# EasyEDA Pro project Signal-blocker-Minimal.epro

# Schematic Schematic1_1

## Sheets
1 Power Supply: Board Name: Minimal; Create Date: 2025-02-25; Page Name: Power Supply; Project Name: Signal-blocker-Minimal; Schematic Name: Schematic1_1; Update Date: 2025-02-25; Company: 嘉立创EDA; Page Size: A4; Version: V1.0
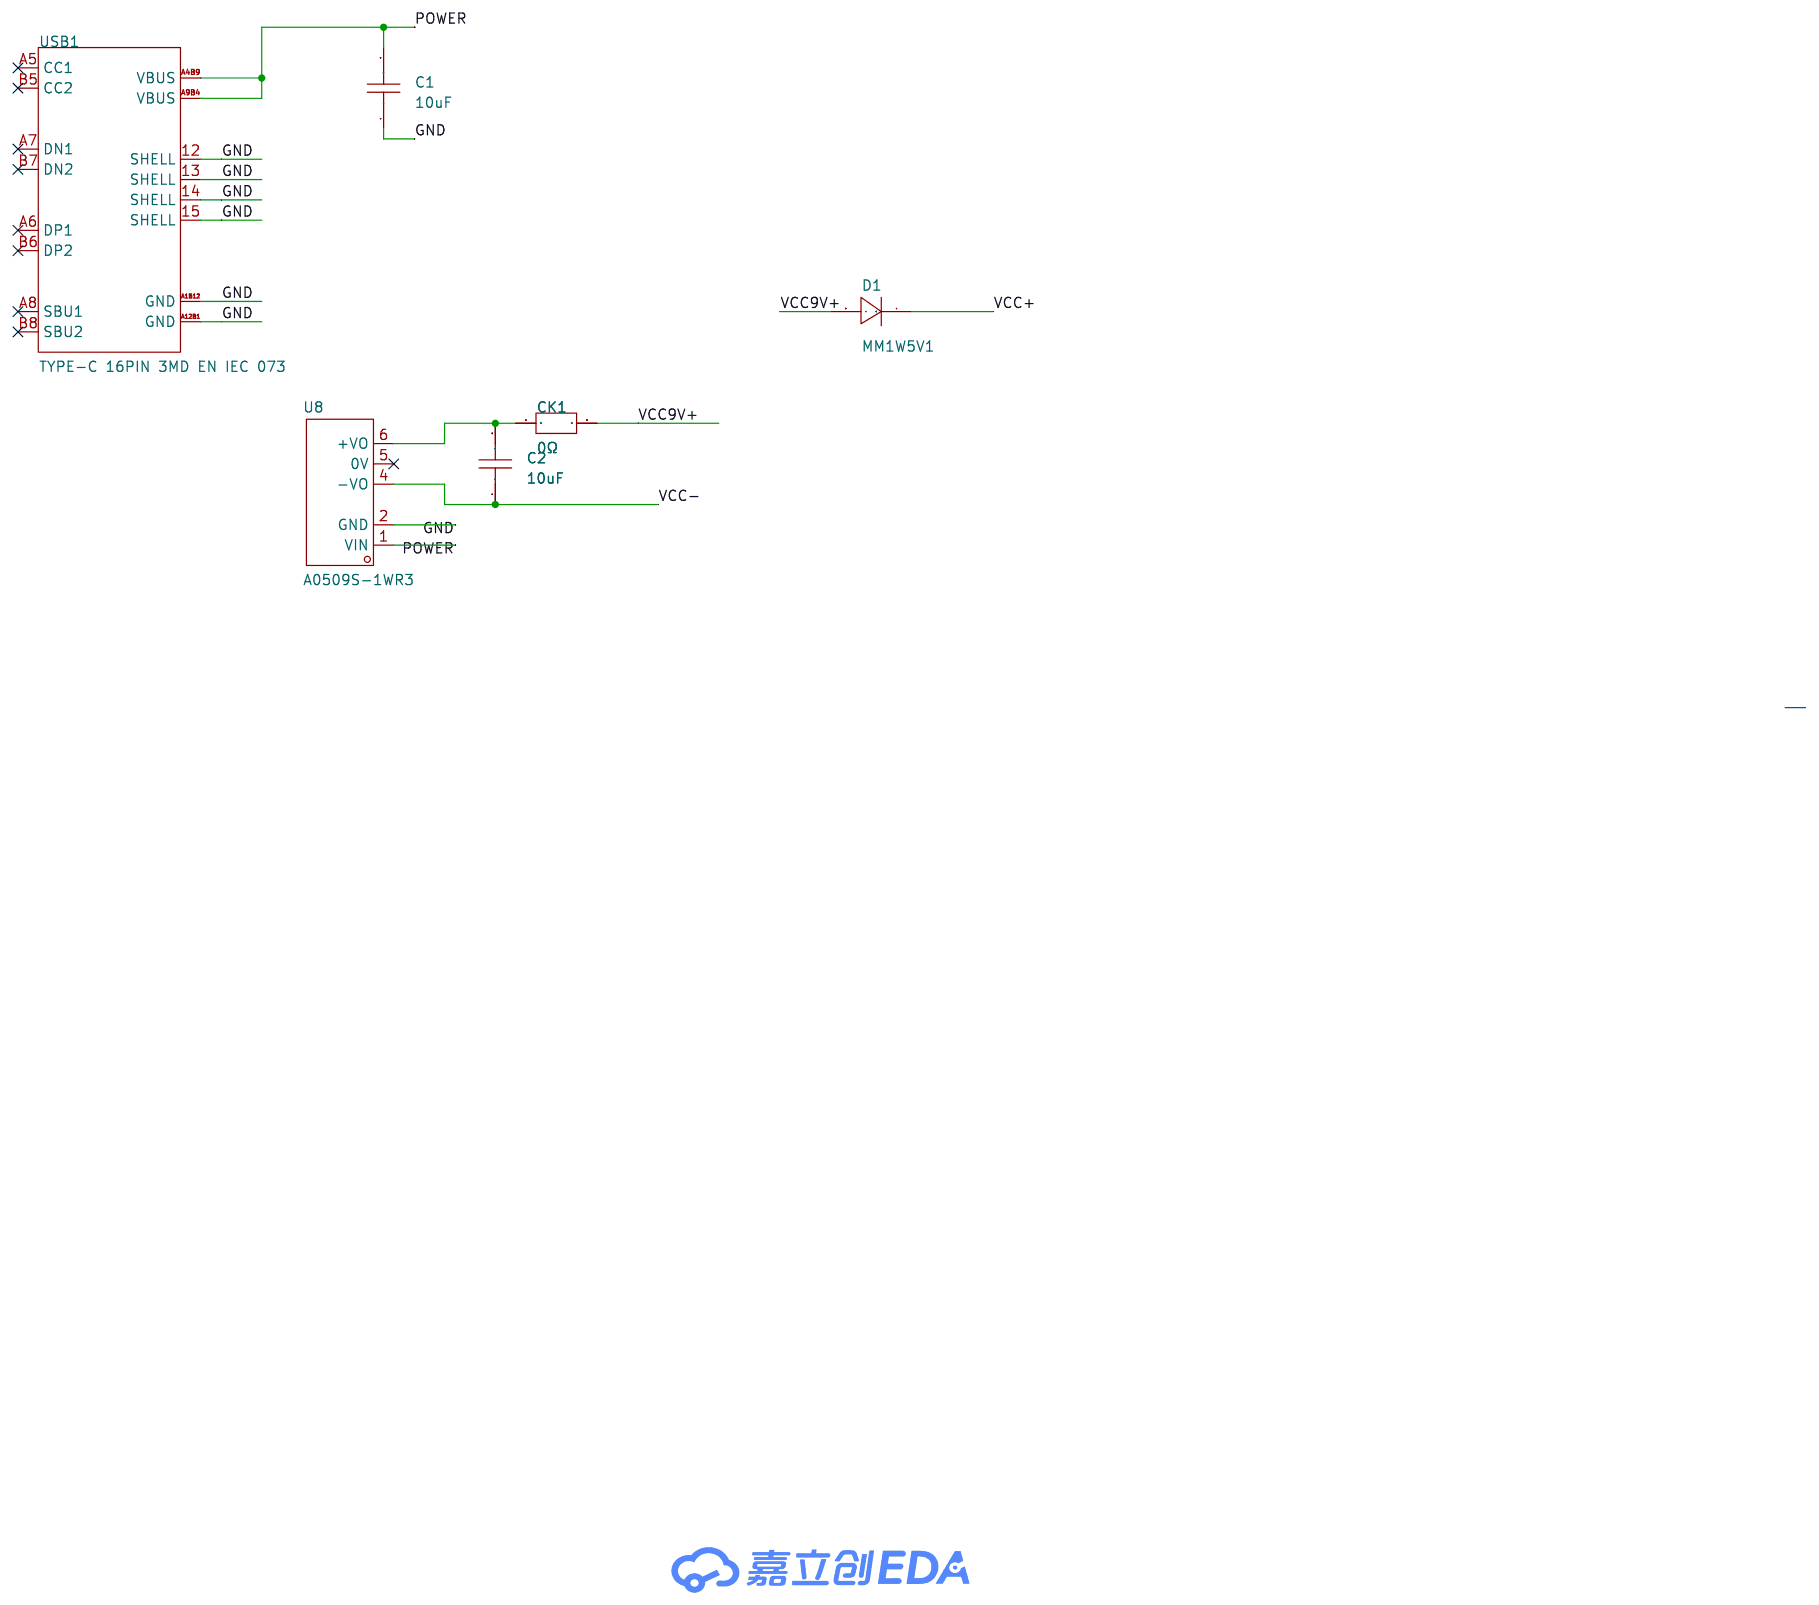
[diagram p0: Power Supply]
2 VCO Module: Page Name: VCO Module
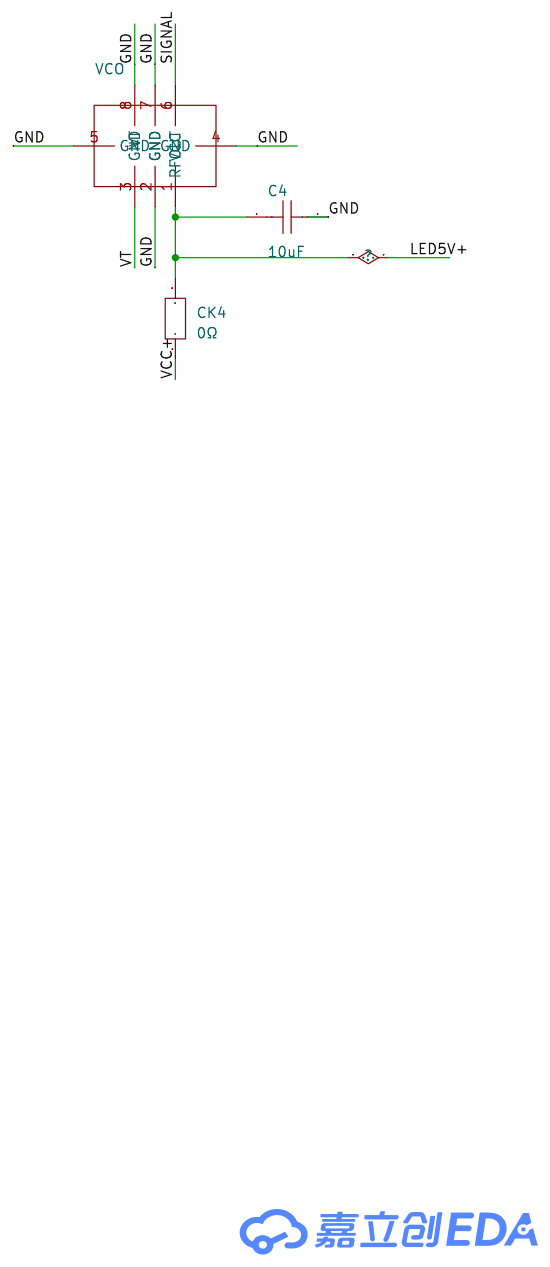
[diagram p1: VCO Module]
3 RFID Module: Page Name: RFID Module
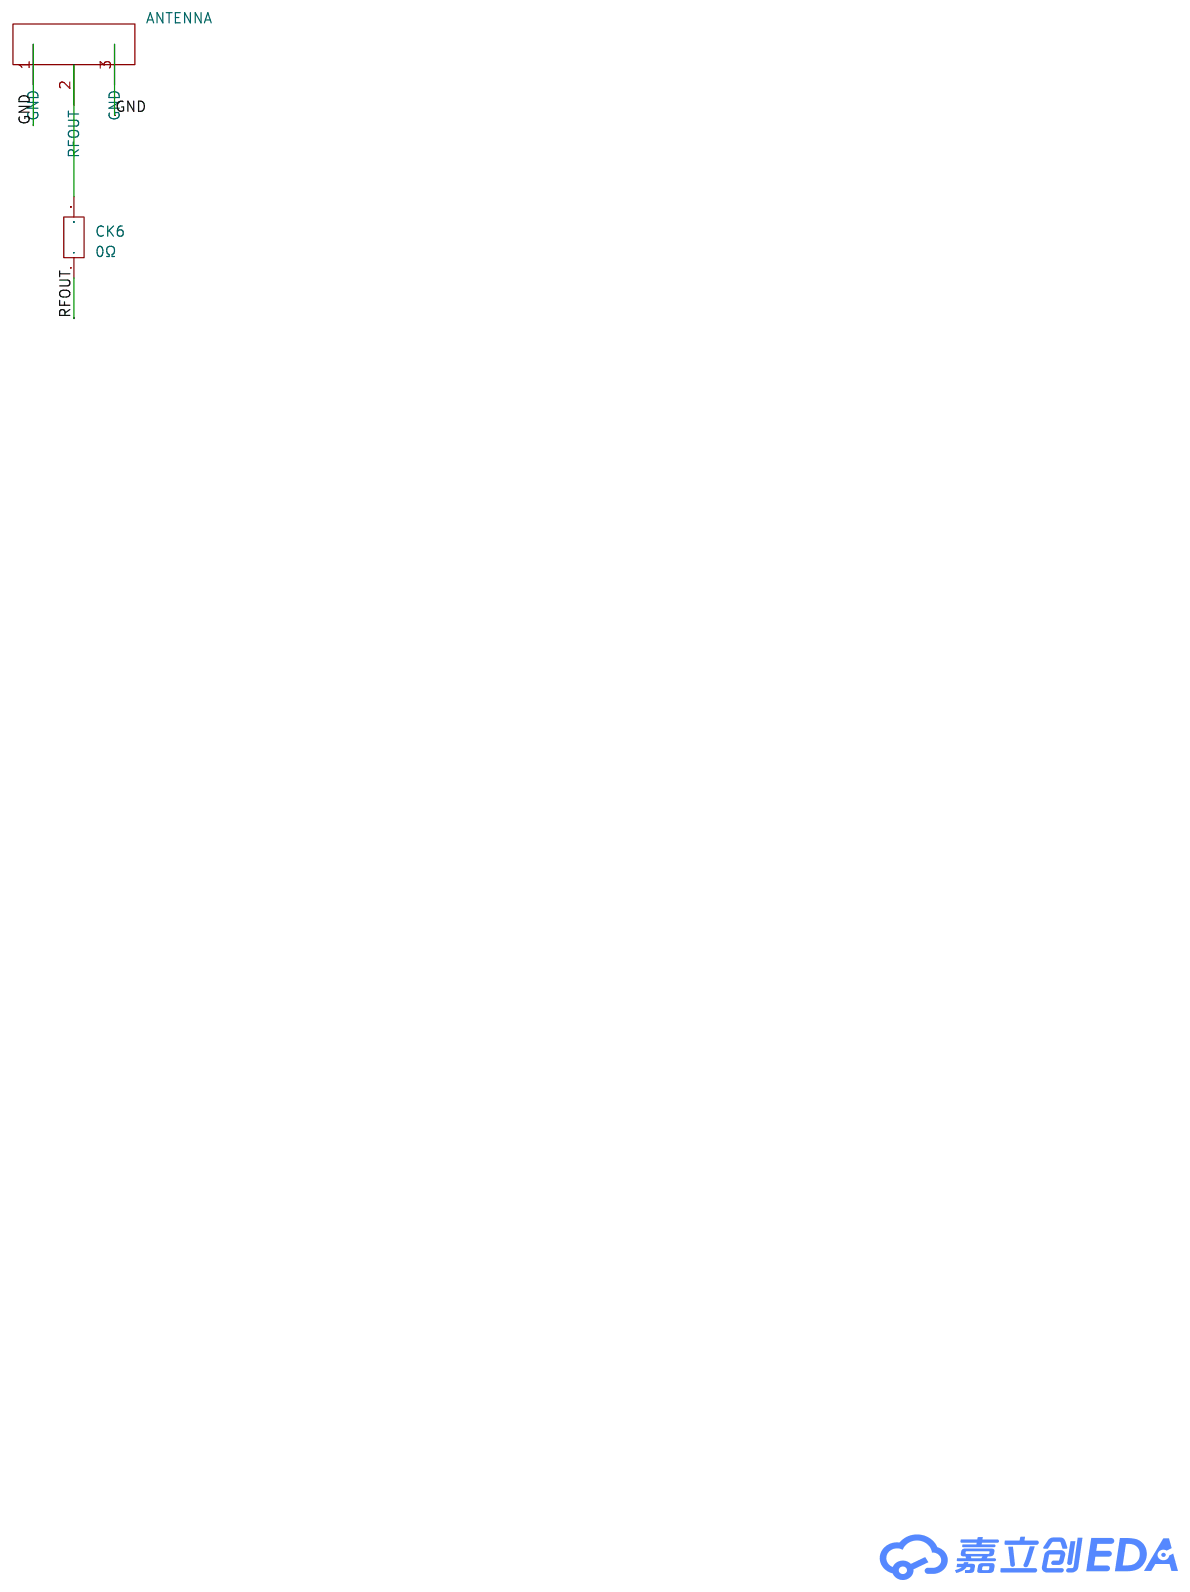
[diagram p2: RFID Module]
4 Voltage-adjust Module: Page Name: Voltage-adjust Module
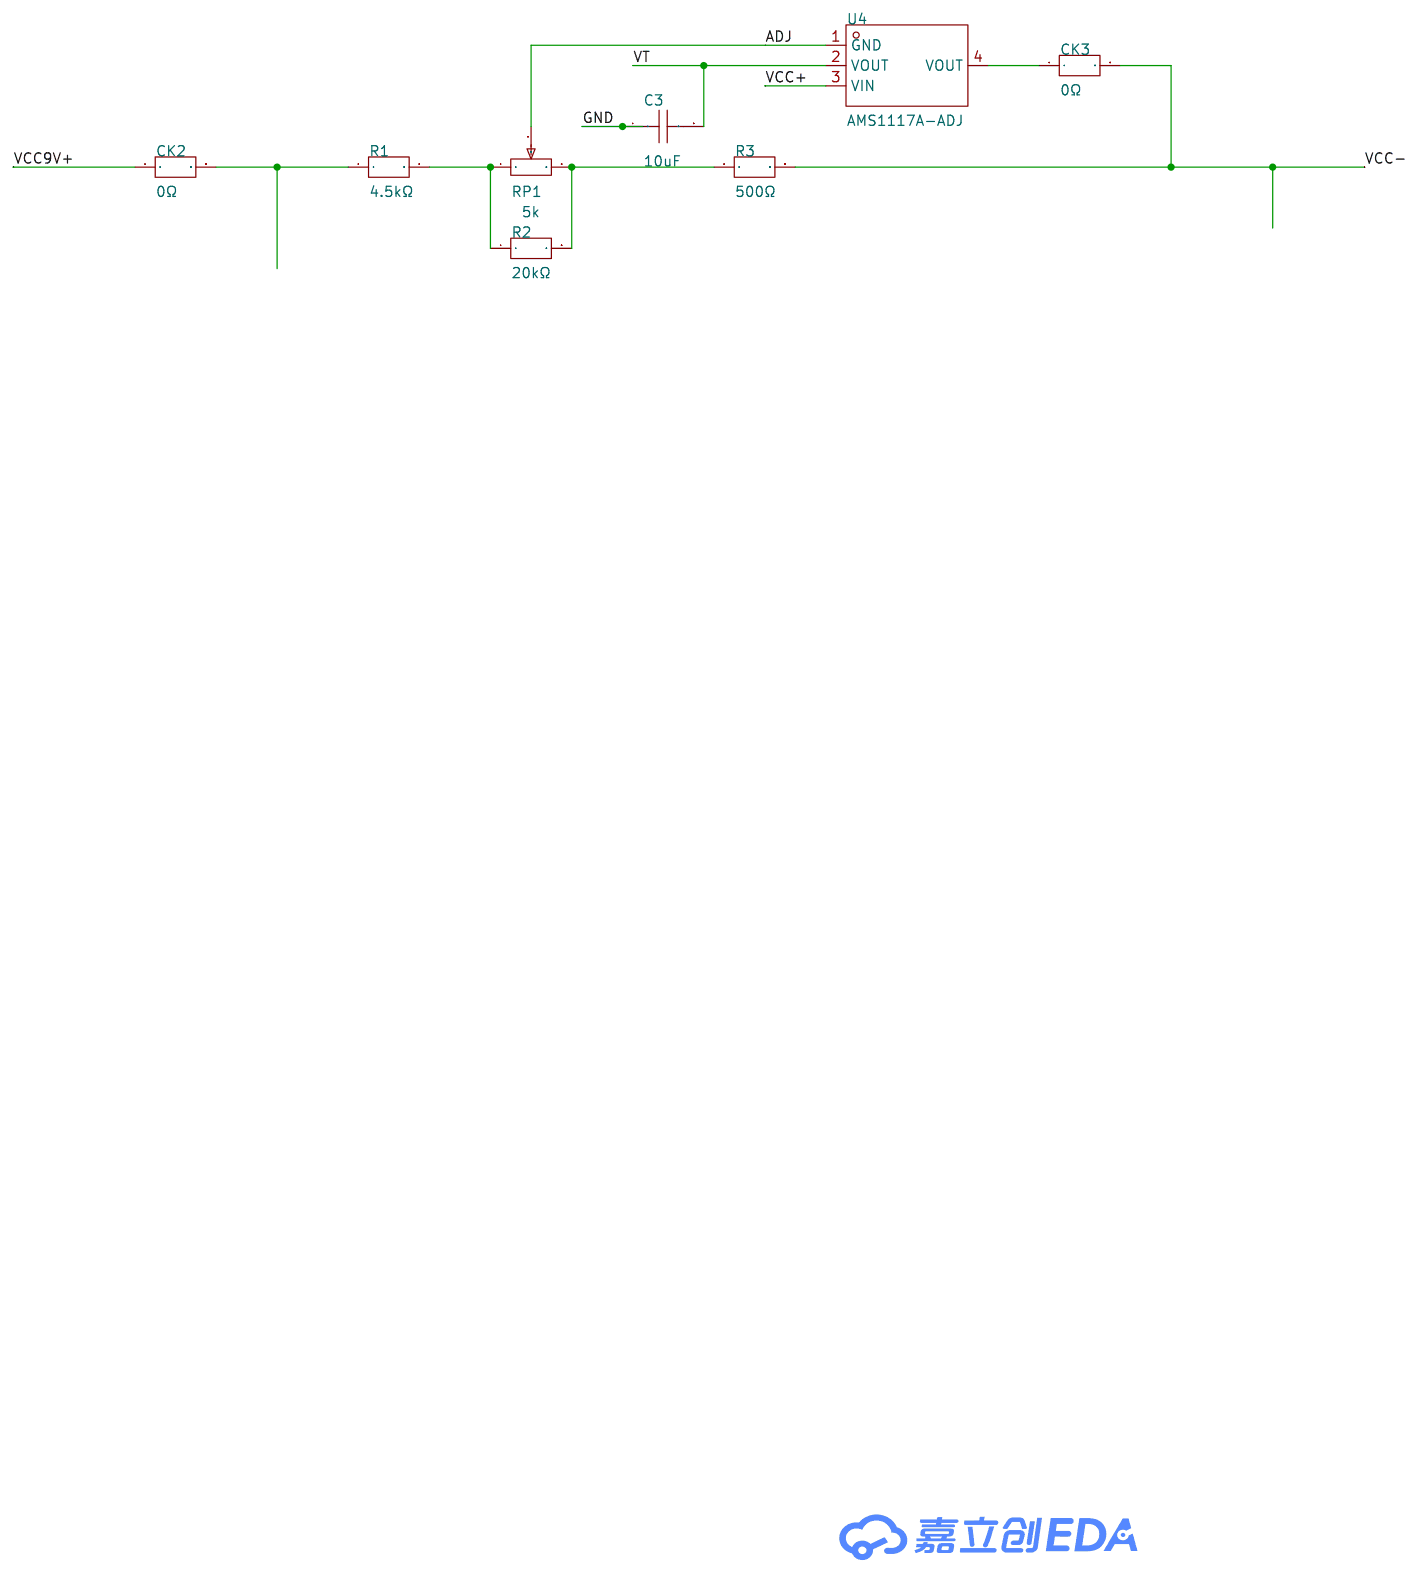
[diagram p3: Voltage-adjust Module]
5 Check Circuit: Page Name: Check Circuit
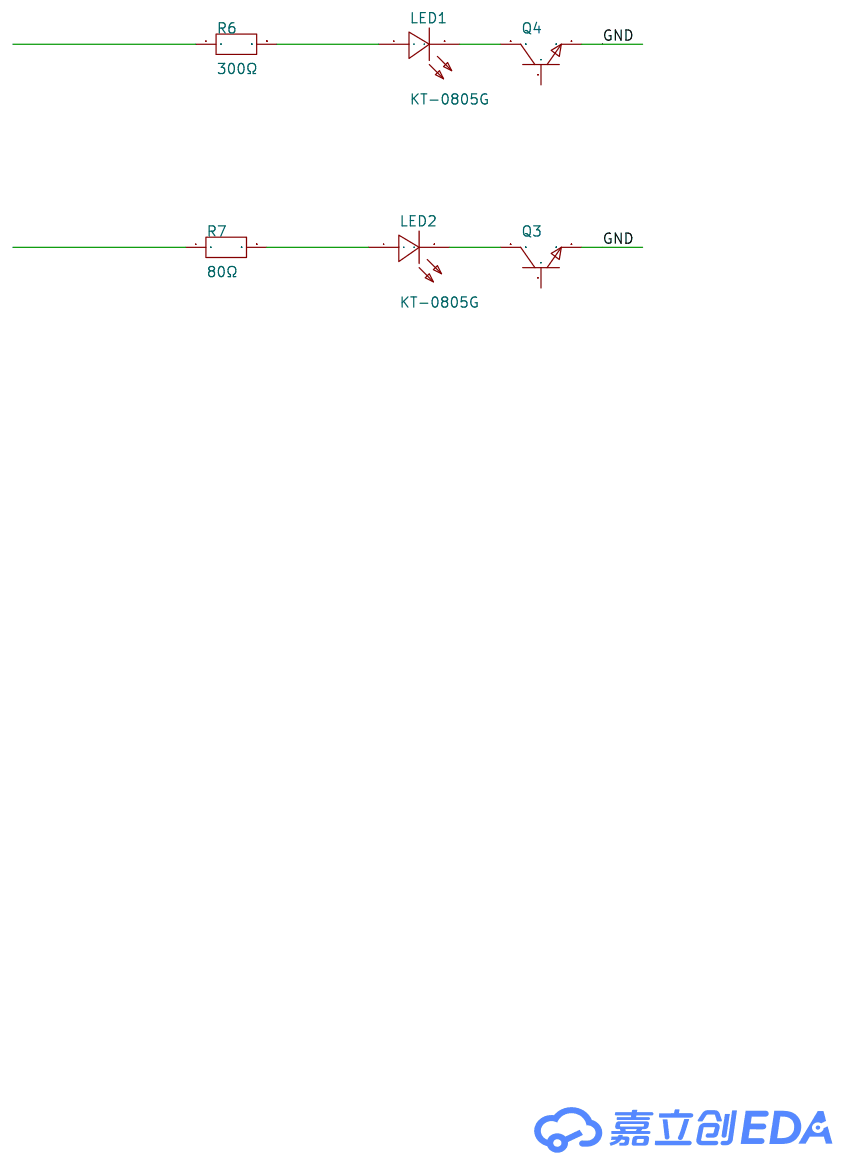
[diagram p4: Check Circuit]
6 Noise-remove Module: Page Name: Noise-remove Module
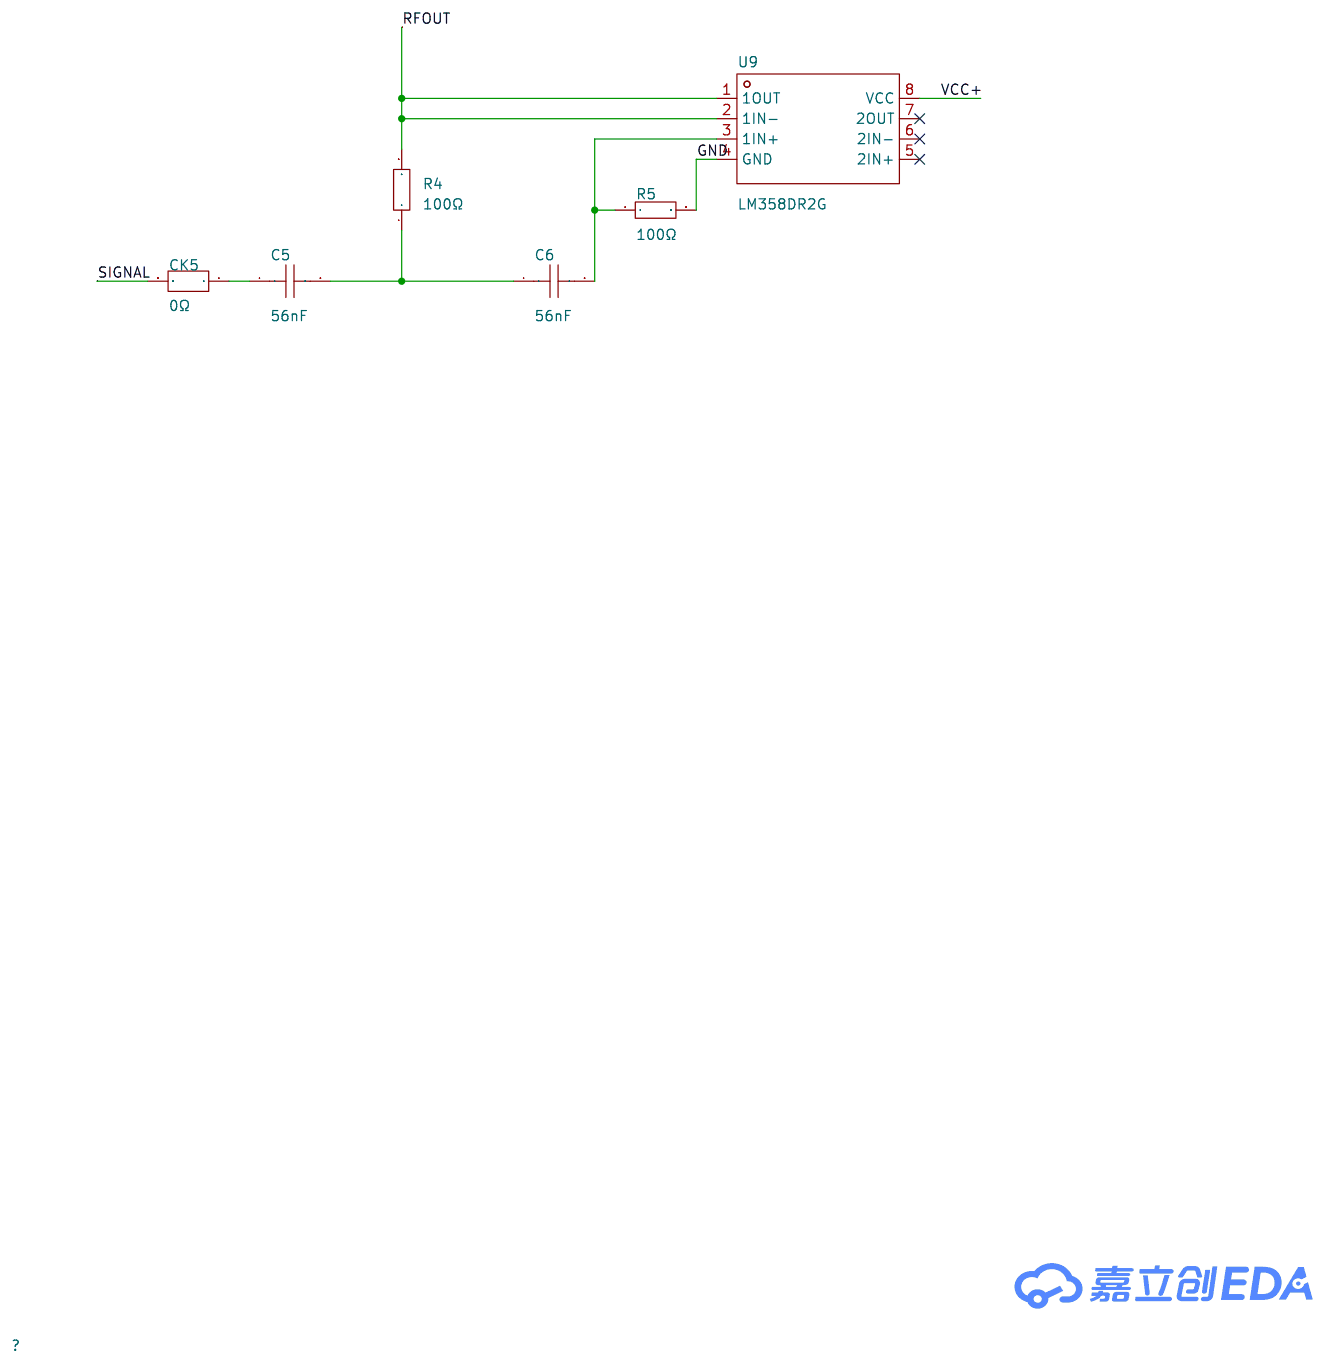
[diagram p5: Noise-remove Module]
7 Signal-enhance Module: Create Date: 2025-02-24
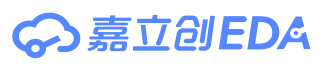
[diagram p6: Signal-enhance Module]

## Parts
sheet Check Circuit
LED1  KT-0805G  [LED0805-R-RD]
LED2  KT-0805G  [LED0805-R-RD]
Q3  -  [S8050_SOT-23]
Q4  -  [S8050_SOT-23]
R6  300Ω  [R2010]
R7  80Ω  [R0603]
sheet Noise-remove Module
C5  56nF  [C0402]
C6  56nF  [C0402]
CK5  0Ω  [R0603]
R4  100Ω  [R0603]
R5  100Ω  [R0603]
U9  LM358DR2G  [SOIC-8_L5.0-W4.0-P1.27-LS6.0-BL]
sheet Power Supply
C1  10uF  [C0603]
C2  10uF  [C0603]
CK1  0Ω  [R0603]
D1  MM1W5V1  [SOD-123_L2.7-W1.6-LS3.7-RD]
U8  A0509S-1WR3  [PWRM-TH_A05XXS-1WR3]
USB1  TYPE-C 16PIN 3MD EN IEC 073  [TYPE-C-SMD_HDGC_TYPE-C-ZL-104PWB]
sheet RFID Module
ANTENNA  -  [wire]
CK6  0Ω  [R0603]
sheet VCO Module
C4  10uF  [C0603]
CK4  0Ω  [R0603]
VCO  -  [1234]
sheet Voltage-adjust Module
C3  10uF  [C0603]
CK2  0Ω  [R0603]
CK3  0Ω  [R0603]
R1  4.5kΩ  [R0603]
R2  20kΩ  [R0603]
R3  500Ω  [R0603]
RP1  5k  [RES-ADJ-SMD_3P-L3.0-W3.8-P1.75-BR]
U4  AMS1117A-ADJ  [SOT-223_L6.3-W3.5-P2.30-LS7.0-BR]

## Library data of the parts
LED1 LED2 = KT-0805G: 灯头类型:-;发光颜色:翠绿色;正向电压(VF):-;功率:-;正向电流:-;主波长:-;二极管配置:-;透镜颜色:-;色温:-;发光强度:-;发光角度:-;载带方式:-;工作温度:-;; LCSC Part Name: 0805 翠绿 高亮; Supplier Part: C2297; Manufacturer: KENTO; Supplier Footprint: 0805; JLCPCB Part Class: 基础库; Datasheet: https://atta.szlcsc.com/upload/public/pdf/source/20170209/1486607340485.pdf; Supplier: LCSC; Emitted Color: 翠绿色
Q3 Q4 = S8050_SOT_NPN: Supplier Footprint: SOT-23
R6 = RS-10K3001FT: 电阻类型:厚膜电阻;阻值:3kΩ;精度:±1%;功率:750mW;温度系数:±100ppm/℃;; LCSC Part Name: 厚膜电阻 3kΩ ±1% 750mW; Supplier Part: C880255; Manufacturer: FH(风华); Supplier Footprint: 2010; JLCPCB Part Class: 扩展库; Datasheet: https://atta.szlcsc.com/upload/public/pdf/source/20140616/1457707091974.pdf; Supplier: LCSC; Type: 厚膜电阻; Tolerance: ±1%; Power(Watts): 750mW; Temperature Coefficient: ±100ppm/℃
R7 = RT0402FRE0780RL: 电阻类型:薄膜电阻;阻值:80Ω;精度:±1%;功率:63mW;温度系数:±50ppm/℃;; LCSC Part Name: 薄膜电阻 80Ω ±1% 63mW; Supplier Part: C854436; Manufacturer: YAGEO(国巨); Supplier Footprint: 0402; JLCPCB Part Class: Extended Part; Datasheet: https://atta.szlcsc.com/upload/public/pdf/source/20200610/C326738_5639A9F1B6EB6E4AE2197577D3456E7F.pdf; Supplier: LCSC; Type: 薄膜电阻; Tolerance: ±1%; Power(Watts): 63mW; Temperature Coefficient: ±50ppm/℃; Operating Temperature Range: -55℃~+155℃
C5 C6 = 0402B563K160CT: 容值:56nF;精度:±10%;额定电压:16V;材质(温度系数):X7R;; LCSC Part Name: 56nF ±10% 16V; Supplier Part: C555392; Manufacturer: Walsin(华新科); Supplier Footprint: 0402; JLCPCB Part Class: 扩展库; Datasheet: https://atta.szlcsc.com/upload/public/pdf/source/20191217/C469650_84AD5C6F618CF4AC0C6D987F2E8FE6F8.pdf; Supplier: LCSC; Tolerance: ±10%; Voltage Rated: 16V; Temperature Coefficient: X7R
CK1-CK6 = 0Ω: Supplier Part: C9900083234; Supplier Footprint: 0603; JLCPCB Part Class: 扩展库; Supplier: LCSC
R4 R5 = 0603WAF1000T5E: 电阻类型:厚膜电阻;阻值:100Ω;精度:±1%;功率:100mW;最大工作电压:75V;温度系数:±200ppm/℃;; LCSC Part Name: 100Ω ±1% 100mW 厚膜电阻; Supplier Part: C22775; Manufacturer: UNI-ROYAL(厚声); Supplier Footprint: 0603; JLCPCB Part Class: Basic Part; Datasheet: https://atta.szlcsc.com/upload/public/pdf/source/20200306/C422600_1E6D84923E4A46A82E41ADD87F860B5C.pdf; Supplier: LCSC; Type: 厚膜电阻; Tolerance: ±1%; Power(Watts): 100mW; Overload Voltage (Max): 75V; Temperature Coefficient: ±200ppm/℃; Operating Temperature Range: -55℃~+155℃
U9 = LM358DR2G: 放大器数:双路;轨到轨:-;增益带宽积(GBP):1MHz;输入失调电压(Vos):7mV;压摆率(SR):-;输入偏置电流(Ib):45nA;; Supplier Part: C7950; Manufacturer: onsemi(安森美); Supplier Footprint: SOIC-8; JLCPCB Part Class: 基础库; Datasheet: https://atta.szlcsc.com/upload/public/pdf/source/20150124/1457707258826.pdf; Supplier: LCSC; Number of Circuits: 双路; Maximum Power Supply Range (Vdd-Vss): 32V; Gain Bandwidth Product(GBP): 1MHz; Voltage - Input Offset(Vos): 7mV; Input Offset Voltage Drift (Vos TC): 7uV/℃; Current - Input Bias(Ib): 45nA; Common Mode Rejection Ratio (CMRR): 70dB; Quiescent Current: 1.5mA; Output Current: 40mA; Operating Temperature: 0℃~+70℃
C1-C4 = HGC0603R5106M160NTHJ: 容值:10uF;精度:±20%;额定电压:16V;材质(温度系数):X5R;; LCSC Part Name: 10uF ±20% 16V; Supplier Part: C7472959; Manufacturer: Chinocera(华瓷); Supplier Footprint: 0603; JLCPCB Part Class: Extended Part; Datasheet: https://atta.szlcsc.com/upload/public/pdf/source/20240320/FAC3FEC40A78BC5CCCE96C232A94D860.pdf; Supplier: LCSC; Tolerance: ±20%; Voltage Rated: 16V; Temperature Coefficient: X5R
D1 = MM1W5V1: 二极管配置:独立式;稳压值(标称值):5.1V;稳压值(范围):4.84V~5.36V;功率(Pd):1W;; LCSC Part Name: 齐纳二极管 5.1V 1W; Supplier Part: C382836; Manufacturer: 晶导微电子; Supplier Footprint: SOD-123; JLCPCB Part Class: 扩展库; Datasheet: https://atta.szlcsc.com/upload/public/pdf/source/20190618/C382951_749579DA53C45F90F6E07B432E1D8FD6.pdf; Supplier: LCSC; Diode Configuration: 独立式; Zener Voltage (Nom): 5.1V; Reverse Leakage Current (Ir): 10uA@1V; Zener Voltage (Range): 4.84V~5.36V; Power Dissipation: 1W; Zener Impedance (Zzt): 7Ω
U8 = A0509S-1WR3_C5369385: A0509S-1WR3 ---是小体积，高效率的微小功率，定电压输入，隔离非稳压正负双路输出，DC/DC 模块电源；该产品是专门针对板上电源系统中需要产生一组与输入电源隔离的电压的应用场合而设计的。该产品适用于：●输入电源的电压比较稳定（电压变化范围±10%Vin）；●输入输出之间要求隔离（隔离电压≤1500VDC）；●对输出电压稳定度要求不高的场合。；●典型应用：纯数字电路场合，一般低频模拟电路场合，继电器驱动电路，数据交换电路场合等;; Supplier Part: C5369385; Manufacturer: YLPTEC(易川); Supplier Footprint: SIP; JLCPCB Part Class: 扩展库; Datasheet: https://atta.szlcsc.com/upload/public/pdf/source/20230712/CE7059F6A87E500D281D8B0F754C5B41.pdf; Supplier: LCSC; TYPE: 升压型; Number of channel: 2; Power: 1W; input voltage (Vdc): 4.5V~5.5V; Conversion Efficiency: 89%; Output Voltage: ±9V; Output Current (Max): ±56mA；±6mA; Maximum Capacitive Load: 560uF; Insulated Voltage: 1500V; Protective function: 短路保护
USB1 = TYPE-C 16PIN 3MD EN IEC 073: TYPE C 16PIN母座 带弹 5A 符合最新欧盟lEC62680-1-3认证; LCSC Part Name: TYPE-C 母座; Supplier Part: C42434192; Manufacturer: SHOU HAN(首韩); Supplier Footprint: SMD; Datasheet: https://atta.szlcsc.com/upload/public/pdf/source/20250103/7C8E9EC35CBB36C3A211B1F25C96EB7A.pdf; Supplier: LCSC
ANTENNA = wire
VCO = vco
R1 = Y40214K50000T9W: 电阻类型:-;阻值:4.5kΩ;精度:±0.01%;功率:100mW;温度系数:±0.2ppm/℃;; LCSC Part Name: 4.5kΩ ±0.01% 100mW; Supplier Part: C3950045; Manufacturer: VISHAY(威世); Supplier Footprint: 0603; JLCPCB Part Class: Extended Part; Supplier: LCSC; Tolerance: ±0.01%; Power(Watts): 100mW; Temperature Coefficient: ±0.2ppm/℃; Operating Temperature Range: -55℃~+125℃
R2 = 0603WAF2002T5E: 电阻类型:厚膜电阻;阻值:20kΩ;精度:±1%;功率:100mW;最大工作电压:75V;温度系数:±100ppm/℃;; LCSC Part Name: 20kΩ ±1% 100mW 厚膜电阻; Supplier Part: C4184; Manufacturer: UNI-ROYAL(厚声); Supplier Footprint: 0603; JLCPCB Part Class: Basic Part; Datasheet: https://atta.szlcsc.com/upload/public/pdf/source/20200306/C422600_1E6D84923E4A46A82E41ADD87F860B5C.pdf; Supplier: LCSC; Type: 厚膜电阻; Tolerance: ±1%; Power(Watts): 100mW; Overload Voltage (Max): 75V; Temperature Coefficient: ±100ppm/℃; Operating Temperature Range: -55℃~+155℃
R3 = RT0603BRC07500RL: 电阻类型:薄膜电阻;阻值:500Ω;精度:±0.1%;功率:100mW;温度系数:±15ppm/℃;; LCSC Part Name: 薄膜电阻 500Ω ±0.1% 100mW; Supplier Part: C860931; Manufacturer: YAGEO(国巨); Supplier Footprint: 0603; JLCPCB Part Class: Extended Part; Supplier: LCSC; Type: 薄膜电阻; Tolerance: ±0.1%; Power(Watts): 100mW; Temperature Coefficient: ±15ppm/℃; Operating Temperature Range: -55℃~+155℃
RP1 = 3X3贴片可调电阻10K可调(贴片可调电阻10K3X3EVM3GSX50B1410k±20%松下): Supplier Part: C9900002171; Supplier Footprint: SMD-3; JLCPCB Part Class: 扩展库; Supplier: LCSC
U4 = AMS1117A-ADJ: Supplier Part: C2984864; Manufacturer: HX(恒佳兴); Supplier Footprint: SOT-223; JLCPCB Part Class: 扩展库; Datasheet: https://atta.szlcsc.com/upload/public/pdf/source/20220408/BD3226BAC8A4B812F5CB2AD559ECEC03.pdf; Supplier: LCSC

## Nets
GND: ANTENNA.1(GND) ANTENNA.3(GND) C1.1 C3.1 C4.2 Q3.2 Q4.2 R5.2 U8.2(GND) U9.4(GND) USB1.12(SHELL) USB1.13(SHELL) USB1.14(SHELL) USB1.15(SHELL) USB1.A1B12(GND) USB1.A12B1(GND) VCO.2(GND) VCO.4(GND) VCO.5(GND) VCO.7(GND) VCO.8(VT)
VCC9V+: CK1.2 CK2.1 D1.2(A)
VCC+: CK4.1 D1.1(C) U4.3(VIN) U9.8(VCC)
VCC-: C2.1 CK3.2 R3.2 U8.4(-VO)
ADJ: RP1.2 U4.1(GND)
LED5V+: C4.1 CK4.2 VCO.1(VCC)
POWER: C1.2 U8.1(VIN) USB1.A4B9(VBUS) USB1.A9B4(VBUS)
RFOUT: CK6.1 R4.2 U9.1(1OUT) U9.2(1IN-)
SIGNAL: CK5.2 VCO.6(RFOUT)
VT: C3.2 U4.2(VOUT) VCO.3(GND)
$3N135: ANTENNA.2(RFOUT) CK6.2
$4N812: CK3.1 U4.4(VOUT)
Net-(C2-2): C2.2 CK1.1 U8.6(+VO)
Net-(C5-1): C5.1 CK5.1
Net-(C5-2): C5.2 C6.1 R4.1
Net-(C6-2): C6.2 R5.1 U9.3(1IN+)
Net-(CK2-2): CK2.2 R1.1
Net-(LED1-1): LED1.1(A) R6.2
Net-(LED1-2): LED1.2(K) Q4.3
Net-(LED2-1): LED2.1(A) R7.2
Net-(LED2-2): LED2.2(K) Q3.3
Net-(R1-2): R1.2 R2.1 RP1.1
Net-(R2-2): R2.2 R3.1 RP1.3

Not connected (* = marked no-connect by the designer): Q3 1; Q4 1; R6 1; R7 1; U8 5(0V)*; U9 5(2IN+)* 6(2IN-)* 7(2OUT)*; USB1 A5(CC1)* A6(DP1)* A7(DN1)* A8(SBU1)* B5(CC2)* B6(DP2)* B7(DN2)* B8(SBU2)*

# Board Minimal
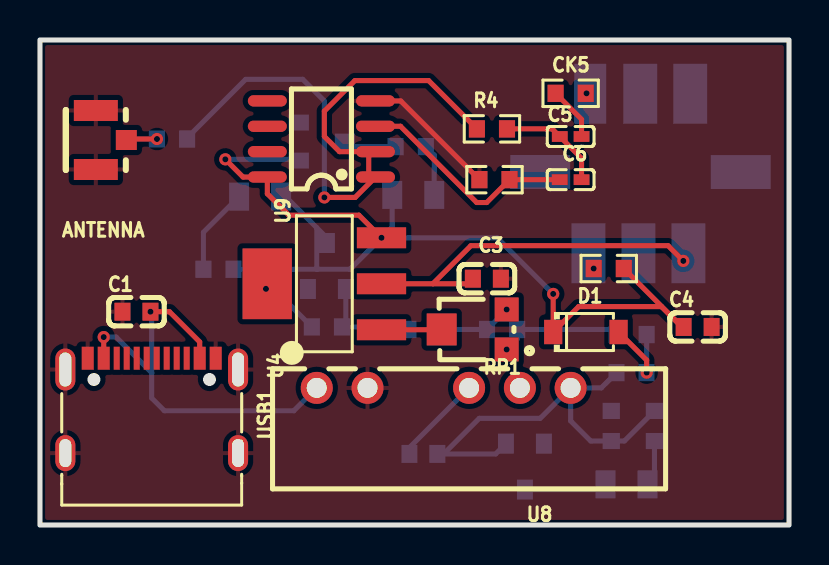
[diagram p7: board, top side]
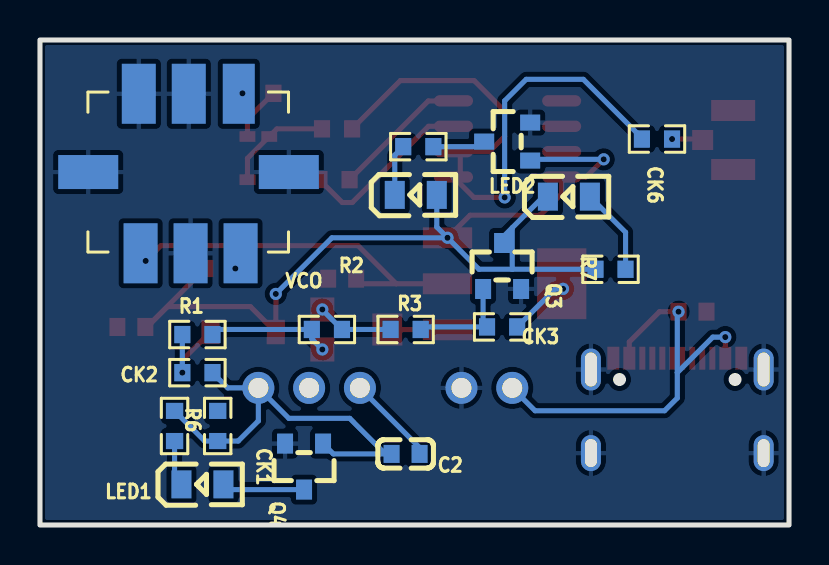
[diagram p8: board, bottom side, seen from below]

Outline 37.47 x 24.26 mm; copper layers: Top Layer, Bottom Layer. Coordinates in mm from the lower left corner of the outline.
Outline path: rectangle 0,24.26 37.47,0
Stack: Top Layer 0.035mm / Dielectric1 1.51mm FR4 er 4.5 / Bottom Layer 0.035mm

## Design rules (mm)
template: JLCPCB Capability(Two Layers Board)
spacing copperThickness1oz (default): track to track 0.102, other pairs 0.152 to 0.3
spacing copperThickness2oz: track to track 0.203, other pairs 0.152 to 0.3
track width copperThickness1oz (default): min 0.127, default 0.254, max 2.54
track width copperThickness2oz: min 0.203, default 0.254, max 2.54
differential pair differentialPair (default): width min 0.127, default 0.254, max 2.54; gap min 0.152, default 0.152
via viaSize (default): diameter min 0.5, default 0.61, max 10; hole min 0.3, default 0.305, max 6.3

## Placement (name value [footprint] x y rotation side)
ANTENNA  -  [wire]  1.02 17.15 90 top
C1  10uF  [C0603]  4.83 10.67 0 top
C2  10uF  [C0603]  19.18 3.56 0 bottom
C3  10uF  [C0603]  22.35 12.32 180 top
C4  10uF  [C0603]  32.89 9.91 0 top
C5  56nF  [C0402]  26.54 19.43 0 top
C6  56nF  [C0402]  26.54 17.27 0 top
CK1  0Ω  [R0603]  28.57 4.95 270 bottom
CK2  0Ω  [R0603]  29.59 7.62 0 bottom
CK3  0Ω  [R0603]  14.35 9.91 0 bottom
CK4  0Ω  [R0603]  28.45 12.83 180 top
CK5  0Ω  [R0603]  26.54 21.59 180 top
CK6  0Ω  [R0603]  6.6 19.3 180 bottom
D1  MM1W5V1  [SOD-123_L2.7-W1.6-LS3.7-RD]  27.31 9.65 0 top
LED1  KT-0805G  [LED0805-R-RD]  29.34 2.03 180 bottom
LED2  KT-0805G  [LED0805-R-RD]  11.01 16.42 180 bottom
LED2#2  -  [LED0805-R-RD]  18.67 16.51 180 bottom
Q3  -  [S8050_SOT-23]  14.48 12.95 270 bottom
Q3#2  -  [S8050_SOT-23]  14.1 19.05 180 bottom
Q4  -  [S8050_SOT-23]  24.13 2.92 90 bottom
R1  4.5kΩ  [R0603]  29.59 9.53 180 bottom
R2  20kΩ  [R0603]  23.11 9.78 0 bottom
R3  500Ω  [R0603]  19.18 9.78 180 bottom
R4  100Ω  [R0603]  22.61 19.81 180 top
R5  100Ω  [R0603]  22.73 17.27 0 top
R6  300Ω  [R0603]  30.73 4.95 270 bottom
R6#2  -  [R0603]  18.54 18.92 0 bottom
R7  80Ω  [R0603]  8.93 12.79 180 bottom
RP1  5k  [RES-ADJ-SMD_3P-L3.0-W3.8-P1.75-BR]  21.72 9.78 0 top
U4  AMS1117A-ADJ  [SOT-223_L6.3-W3.5-P2.30-LS7.0-BR]  14.22 12.07 0 top
U8  A0509S-1WR3  [PWRM-TH_A05XXS-1WR3]  20.19 6.86 0 top
U9  LM358DR2G  [SOIC-8_L5.0-W4.0-P1.27-LS6.0-BL]  14.08 19.31 90 top
USB1  TYPE-C 16PIN 3MD EN IEC 073  [TYPE-C-SMD_HDGC_TYPE-C-ZL-104PWB]  5.59 5.97 0 top
VCO  -  [1234]  29.46 17.65 0 bottom

## Footprints (pads in the part's own frame, mm; a bottom-side part is the same pattern mirrored in y, then rotated)
1234
  custom 1.7x3 smd: 1(-2.031,4.064) 2(0.469,4.064) 3(2.969,4.064) 7(0.558,-3.913) 8(3.058,-3.913)
  rect 3x1.7 smd: 4(-4.445,0) 5(5.588,0)
  rect 1.6x3 smd: 6(-1.942,-3.913)
C0402
  rect 0.79x0.54 smd: 1(-0.545,0) 2(0.545,0)
C0603
  rect 0.8x0.9 smd: 1(-0.7,0) 2(0.7,0)
LED0805-R-RD
  rect 1x1.399 smd: 1(1.05,0) 2(-1.05,0)
PWRM-TH_A05XXS-1WR3
  round 1.6 hole 1: 1(-6.35,0) 2(-3.81,0) 4(1.27,0) 5(3.81,0) 6(6.35,0)
R0603
  rect 0.806x0.864 smd: 1(-0.753,0) 2(0.753,0)
RES-ADJ-SMD_3P-L3.0-W3.8-P1.75-BR
  rect 1.2x1.2 smd: 1(1.625,-1) 3(1.625,1)
  rect 1.5x1.6 smd: 2(-1.625,0)
S8050_SOT-23
  rect 1x0.8 smd: 1(1.15,-0.823) 2(1.15,1.077) 3(-1.15,0.127)
SOD-123_L2.7-W1.6-LS3.7-RD
  rect 0.91x1.22 smd: 1(-1.635,0) 2(1.635,0)
SOIC-8_L5.0-W4.0-P1.27-LS6.0-BL
  oval 0.569x1.95 smd: 1(-1.905,-2.705) 2(-0.635,-2.705) 3(0.635,-2.705) 4(1.905,-2.705) 5(1.905,2.705) 6(0.635,2.705) 7(-0.635,2.705) 8(-1.905,2.705)
SOT-223_L6.3-W3.5-P2.30-LS7.0-BR
  rect 2.465x1.05 smd: 1(2.857,-2.3) 2(2.857,0) 3(2.857,2.3)
  rect 2.465x3.54 smd: 4(-2.857,0)
TYPE-C-SMD_HDGC_TYPE-C-ZL-104PWB
  oval 1x2.1 hole 0.6x1.7: 12(-4.32,1.808) 13(4.32,1.808)
  oval 1x1.8 hole 0.6x1.4: 14(-4.32,-2.373) 15(4.32,-2.373)
  rect 0.6x1.15 smd: A1B12(-3.2,2.373) A4B9(-2.4,2.373) A9B4(2.4,2.373) A12B1(3.2,2.373)
  rect 0.3x1.15 smd: A5(-1.25,2.373) A6(-0.25,2.373) A7(0.25,2.373) A8(1.25,2.373) B5(1.75,2.373) B6(0.75,2.373) B7(-0.75,2.373) B8(-1.75,2.373)
wire
  rect 1.05x2.2 smd: 1(0.635,-1.778) 3(3.585,-1.778)
  rect 1x1.05 smd: 2(2.11,-3.303)

## Nets
GND: ANTENNA.1 ANTENNA.3 C1.1 C3.1 C4.2 Q3.2 Q3#2.2 Q4.2 R5.1 U8.2 U9.4 USB1.12 USB1.13 USB1.14 USB1.15 USB1.A1B12 USB1.A12B1 VCO.2 VCO.4 VCO.5 VCO.7 VCO.8
VCC9V+: C2.2 CK1.1 CK1.2 CK2.1 LED1.1 LED1.2 Q4.1 Q4.3 R6.1 R6.2 U8.6
VCC+: C4.1 CK2.2 CK4.1 CK4.2 D1.1 D1.2 LED2.2 LED2#2.1 Q3.3 Q3#2.1 Q3#2.3 R1.1 R6#2.1 R7.1 U4.3 U9.8 VCO.1
VCC-: C2.1 U8.4
ADJ: RP1.2 U4.1
POWER: C1.2 U8.1 USB1.A4B9 USB1.A9B4
RFOUT: CK6.1 R4.2 U9.1 U9.2
SIGNAL: CK5.1 VCO.6
VT: C3.2 U4.2 VCO.3
$3N135: ANTENNA.2 CK6.2
$4N521: R2.1 R3.1 RP1.3
$4N526: CK3.2 Q3.1 R1.2 R2.2 R3.2 RP1.1
$4N812: CK3.1 U4.4
$5N863: LED2.1 LED2#2.2 R6#2.2 R7.2
$6N289: C5.2 C6.1 CK5.2 R5.2 U9.3
$6N676: C5.1 C6.2 R4.1

Pads without a net: U8 5; U9 5 6 7; USB1 A5 A6 A7 A8 B5 B6 B7 B8

## Via types
v1: diameter 0.61, hole 0.305, Top Layer to Bottom Layer, 14 vias

## Routing (per net, layer and track width the routed paths; a pad name or vN(x,y) marks a point on that pad's centre or on a via; arc(x,y) is an arc through that point)
GND: length 6.8
  Top Layer w0.254: R5.1 18.04,21.21 16.79,21.21 U9.4
VCC9V+: length 27.3
  Bottom Layer w0.254: 20.19,3.56 C2.2 ; 20.19,3.56 21.97,5.33 25.02,5.33 U8.6 ; 20.19,3.56 22.79,3.56 Q4.1 ; U8.6 26.54,5.21 27.55,4.2 CK1.2 29.23,4.2 R6.1 ; U8.6 28.08,6.86 CK2.1 ; R6.2 30.73,2.38 LED1.2 ; Q4.3 28.03,1.77 LED1.1
VCC+: length 59.6
  Top Layer w0.254: v1(9.27,18.29) 10.16,17.4 U9.8 11.37,16.57 12.45,15.49 15.95,15.49 v1(17.08,14.37) ; CK4.1 32.1,9.93 32.1,9.91 31.08,10.92 26.94,10.92 25.67,9.65 v1(25.67,11.56) ; v1(30.34,7.62) 30.34,8.25 D1.2
  Bottom Layer w0.254: LED2.2 12.29,16.42 13.84,14.87 ; 13.84,12.79 13.84,14.87 ; 13.84,12.79 R7.1 ; 13.84,12.79 15.51,12.79 v1(17.08,14.37) ; 13.84,14.87 14.35,14.36 ; LED2#2.1 17.62,14.9 v1(17.08,14.37) ; R1.1 v1(30.34,7.62) ; v1(9.27,18.29) 12.89,18.29 Q3#2.1 ; R6#2.1 15.5,18.92 Q3#2.3 ; v1(25.67,11.56) 22.86,14.37 v1(17.08,14.37)
  vias: v1(27.69,12.83)
VCC-: length 4.5
  Bottom Layer w0.254: C2.1 18.48,3.87 U8.4
ADJ: length 3
  Top Layer w0.254: U4.1 20.08,9.77 RP1.2
POWER: length 21.4
  Top Layer w0.254: v1(5.53,10.67) 6.48,10.67 7.99,9.16 USB1.A9B4 ; USB1.A4B9 v1(3.19,9.4)
  Bottom Layer w0.254: U8.1 12.7,5.72 6.22,5.72 5.59,6.35 5.59,7.62 ; v1(3.19,9.4) 3.81,9.4 5.59,7.62 ; 5.59,7.62 5.59,10.61 v1(5.53,10.67)
RFOUT: length 30.9
  Top Layer w0.254: 16.44,18.67 16.44,17.53 ; 16.44,18.67 U9.2 ; 16.44,18.67 14.98,18.67 14.22,19.43 14.22,20.7 15.75,22.23 19.44,22.23 R4.2 ; v1(14.22,16.38) 15.76,16.38 U9.1
  Bottom Layer w0.254: CK6.1 7.36,19.36 10.29,22.29 13.14,22.29 14.22,21.21 v1(14.22,16.38)
SIGNAL:
  vias: v1(27.34,21.59)
VT: length 18.3
  Top Layer w0.254: 21.65,12.19 21.53,12.07 19.65,12.07 ; v1(32.18,13.21) 31.42,13.97 21.55,13.97 19.65,12.07 ; 19.65,12.07 U4.2
$3N135: length 1.6
  Top Layer w0.254: ANTENNA.2 4.37,19.3 v1(5.85,19.3)
$4N521: length 3.8
  Bottom Layer w0.254: R3.1 R2.1 23.34,10.76 v1(23.34,10.78)
$4N526: length 11.9
  Bottom Layer w0.254: R3.2 18.3,9.91 CK3.2 15.3,10.1 15.3,12.06 ; R1.2 28.58,9.78 R2.2 23.87,9.3 v1(23.34,8.78)
$4N812: length 3.1
  Bottom Layer w0.254: v1(11.3,11.81) 11.69,11.81 CK3.1
$5N863: length 7
  Bottom Layer w0.254: LED2.1 8.18,14.64 R7.2 ; LED2#2.2 19.72,18.5 R6#2.2
$6N289: length 14
  Top Layer w0.254: 26,17.27 R5.2 22.34,16.13 21.84,16.13 18.03,19.94 U9.3 ; 27.11,19.41 C5.2 27.09,20.29 CK5.2
$6N676: length 5.4
  Top Layer w0.254: R4.1 25.62,19.81 27.09,18.34 C6.2

## Copper pours and planes (outline as drawn; the poured copper is in the pictures)
GND on Top Layer: 0,24.26 37.47,24.26 37.47,0 0,0
GND on Bottom Layer: 0,24.26 37.47,24.26 37.47,0 0,0
GND on Bottom Layer: 0,24.26 37.47,24.26 37.47,0 0,0
